# EAGLE design eth_module (EAGLE 6.3)
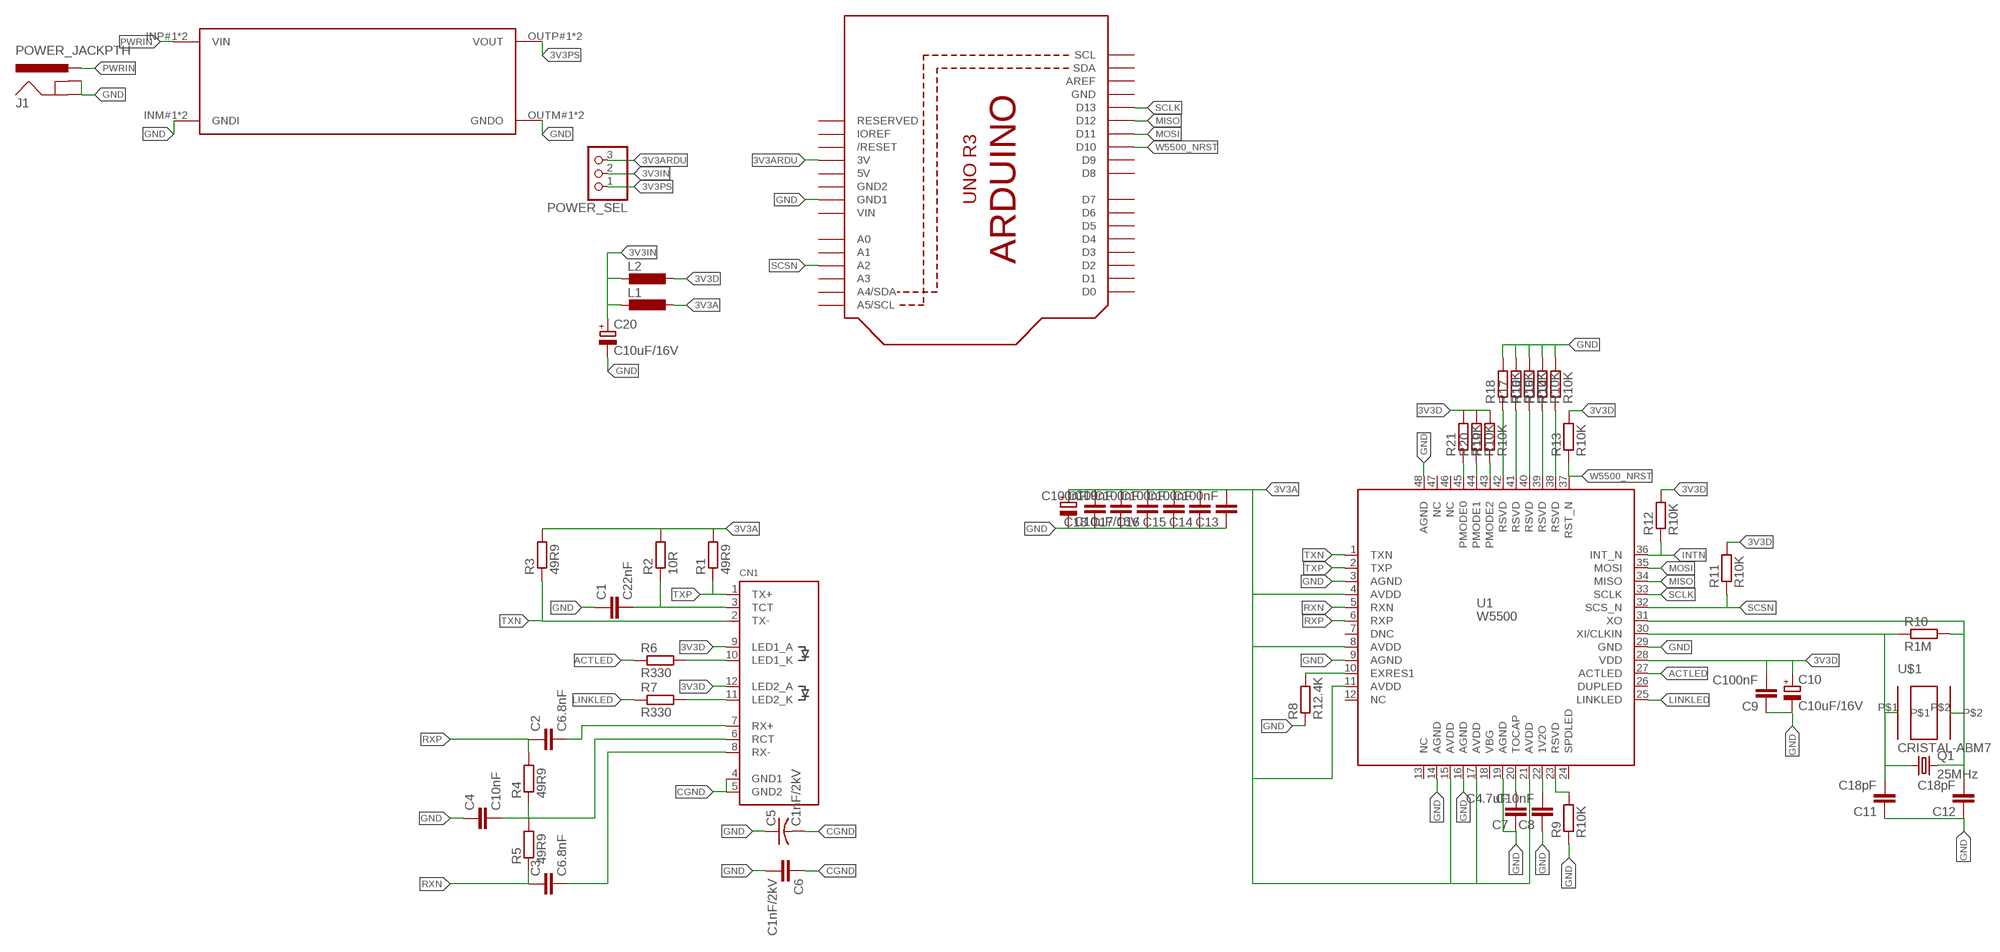
[diagram p0: schematic, sheet 1]

## Parts
C1  C22nF  C-EUC0603  [C0603]
C2  C6.8nF  C-EUC0603  [C0603]
C3  C6.8nF  C-EUC0603  [C0603]
C4  C10nF  C-EUC0603  [C0603]
C5  C1nF/2kV  C-US025-025X050  [C025-025X050]
C6  C1nF/2kV  C-EUC0603  [C0603]
C7  C4.7uF  C-EUC0603  [C0603]
C8  C10nF  C-EUC0603  [C0603]
C9  C100nF  C-EUC0603  [C0603]
C10  C10uF/16V  CPOL-EU153CLV-0605  [153CLV-0605]
C11  C18pF  C-EUC0603  [C0603]
C12  C18pF  C-EUC0603  [C0603]
C13  C100nF  C-EUC0603  [C0603]
C14  C100nF  C-EUC0603  [C0603]
C15  C100nF  C-EUC0603  [C0603]
C16  C100nF  C-EUC0603  [C0603]
C17  C100nF  C-EUC0603  [C0603]
C18  C100nF  C-EUC0603  [C0603]
C19  C10uF/16V  CPOL-EU153CLV-0605  [153CLV-0605]
C20  C10uF/16V  CPOL-EU153CLV-0605  [153CLV-0605]
CN1  RJ45J0026D21BNL  [RJ45_PULSEJACK]
J1  POWER_JACKPTH  [POWER_JACK_PTH]
L1  L-EUL2012C  [L2012C]
L2  L-EUL2012C  [L2012C]
POWER_SEL  PINHD-1X3  [1X03]
Q1  25MHz  CRYSTALHC49S  [HC49/S]
R1  49R9  R-EU_R0603  [R0603]
R2  10R  R-EU_R0603  [R0603]
R3  49R9  R-EU_R0603  [R0603]
R4  49R9  R-EU_R0603  [R0603]
R5  49R9  R-EU_R0603  [R0603]
R6  R330  R-EU_R0603  [R0603]
R7  R330  R-EU_R0603  [R0603]
R8  R12.4K  R-EU_R0805  [R0805]
R9  R10K  R-EU_R0603  [R0603]
R10  R1M  R-EU_R0603  [R0603]
R11  R10K  R-EU_R0603  [R0603]
R12  R10K  R-EU_R0603  [R0603]
R13  R10K  R-EU_R0603  [R0603]
R14  R10K  R-EU_R0603  [R0603]
R15  R10K  R-EU_R0603  [R0603]
R16  R10K  R-EU_R0603  [R0603]
R17  R10K  R-EU_R0603  [R0603]
R18  R10K  R-EU_R0603  [R0603]
R19  R10K  R-EU_R0603  [R0603]
R20  R10K  R-EU_R0603  [R0603]
R21  R10K  R-EU_R0603  [R0603]
U1  W5500  [W5500]
U2  ARDUINOR3-DIMENSION  [ARDUINOR3]
U$1  CRISTAL-ABM7  [CRISTAL-ABM7]
U$2  DCDCMODULE_SMALL  [DCDCMODULE-SMALL]

## Nets
3V3A: C13.2 C14.2 C15.2 C16.2 C17.2 C18.2 C19.+ L1.1 R1.2 R2.2 R3.2 U1.4(AVDD) U1.8(AVDD) U1.11(AVDD) U1.15(AVDD) U1.17(AVDD) U1.21(AVDD)
3V3ARDU: POWER_SEL.3 U2.3V
3V3D: C9.2 C10.+ CN1.9(LED1_A) CN1.12(LED2_A) L2.1 R11.2 R12.2 R13.2 R19.2 R20.2 R21.2 U1.28(VDD)
3V3IN: C20.+ L1.2 L2.2 POWER_SEL.2
3V3PS: POWER_SEL.1 U$2.OUTP#1(VOUT) U$2.OUTP#2(VOUT)
ACTLED: R6.1 U1.27(ACTLED)
CGND: C5.2 C6.1 CN1.4(GND1) CN1.5(GND2)
GND: C1.1 C4.1 C5.1 C6.2 C7.1 C8.1 C9.1 C10.- C11.1 C12.1 C13.1 C14.1 C15.1 C16.1 C17.1 C18.1 C19.- C20.- J1.GND J1.GNDBREAK R8.1 R9.1 R14.2 R15.2 R16.2 R17.2 R18.2 U1.3(AGND) U1.9(AGND) U1.14(AGND) U1.16(AGND) U1.19(AGND) U1.29(GND) U1.48(AGND) U2.GND1 U$2.INM#1(GNDI) U$2.INM#2(GNDI) U$2.OUTM#1(GNDO) U$2.OUTM#2(GNDO)
INTN: R12.1 U1.36(INT_N)
LINKLED: R7.1 U1.25(LINKLED)
MISO: U1.34(MISO) U2.D12
MOSI: U1.35(MOSI) U2.D11
N$1: CN1.10(LED1_K) R6.2
N$2: C1.2 CN1.3(TCT) R2.1
N$3: CN1.11(LED2_K) R7.2
N$4: C2.2 CN1.7(RX+)
N$5: C7.2 U1.20(TOCAP)
N$6: C4.2 CN1.6(RCT) R4.1 R5.2
N$7: R9.2 U1.23(RSVD)
N$8: C3.2 CN1.8(RX-)
N$9: R8.2 U1.10(EXRES1)
N$10: C11.2 Q1.1 R10.1 U1.30(XI/CLKIN) U$1.P$1
N$11: C8.2 U1.22(1V2O)
N$12: C12.2 Q1.2 R10.2 U1.31(XO) U$1.P$2
N$13: R14.1 U1.38(RSVD)
N$14: R15.1 U1.39(RSVD)
N$15: R16.1 U1.40(RSVD)
N$16: R17.1 U1.41(RSVD)
N$17: R18.1 U1.42(RSVD)
N$18: R21.1 U1.45(PMODE0)
N$19: R20.1 U1.44(PMODE1)
N$20: R19.1 U1.43(PMODE2)
PWRIN: J1.PWR U$2.INP#1(VIN) U$2.INP#2(VIN)
RXN: C3.1 R5.1 U1.5(RXN)
RXP: C2.1 R4.2 U1.6(RXP)
SCLK: U1.33(SCLK) U2.D13
SCSN: R11.1 U1.32(SCS_N) U2.A2
TXN: CN1.2(TX-) R3.1 U1.1(TXN)
TXP: CN1.1(TX+) R1.1 U1.2(TXP)
W5500_NRST: R13.1 U1.37(RST_N) U2.D10
Unconnected: U1.7(DNC) U1.12(NC) U1.13(NC) U1.18(VBG) U1.24(SPDLED) U1.26(DUPLED) U1.46(NC) U1.47(NC) U2.A0 U2.A1 U2.A3 U2.A4(A4/SDA) U2.A5(A5/SCL) U2.AREF U2.D0 U2.D1 U2.D2 U2.D3 U2.D4 U2.D5 U2.D6 U2.D7 U2.D8 U2.D9 U2.IOREF U2.RESERVED U2.RESET(/RESET) U2.SCL U2.SDA

## Power pins joined to a net without a drawn wire
5VPS: U2.5V
GND: U2.GND
GND2: U2.GND2
VIN: U2.VIN

## Library data of the parts
C1-C4 C6-C9 C11-C18 = resistor:C-EU: CAPACITOR, European symbol
C5 = resistor:C-US: CAPACITOR, American symbol
C10 C19 C20 = resistor:CPOL-EU: POLARIZED CAPACITOR, European symbol
CN1 = microbuilder:RJ45: RJ45 (Ethernet) Connectors J0026D21BNL - RJ45 Connector with internal transformer and 2 LEDs (Yellow/Green). LEDs have max foreward-voltage of 2.5V. LEDs require an external resistor. Digikey: 553-1349-ND J00-0065NL - RJ45 Connector with internal transformer and 2 LEDs (Yellow/Green). LEDs have max foreward-voltage of 2.5V. LEDs require an external resistor. Digikey: 553-1345-ND
J1 = SparkFun-Connectors:POWER_JACK: Power Jack This is the standard 5.5mm barrel jack for power. The PTH is the most common, proven, reliable, footprint. The Slot footprint only works if the mill layer is transmitted to the PCB fab house so be warned. Mating wall wart : TOL-00298 (and others); PROD_ID: PRT-00119
L1 L2 = resistor:L-EU: INDUCTOR, European symbol
POWER_SEL = adafruit:PINHD-1X3: PIN HEADER
Q1 = crystal:CRYSTAL: CRYSTAL; OC_FARNELL: 1667008; OC_NEWARK: unknown
R1-R21 = resistor:R-EU_: RESISTOR, European symbol
U1 = W5500:W5500
U2 = adafruit:ARDUINOR3: This is a new object for the new Arduino R3 - with extra pins that you may want to use (such as IOref, and duplicated A4/A5
U$1 = cristal:CRISTAL-ABM7
U$2 = bontor:DCDCMODULE_SMALL

## Board
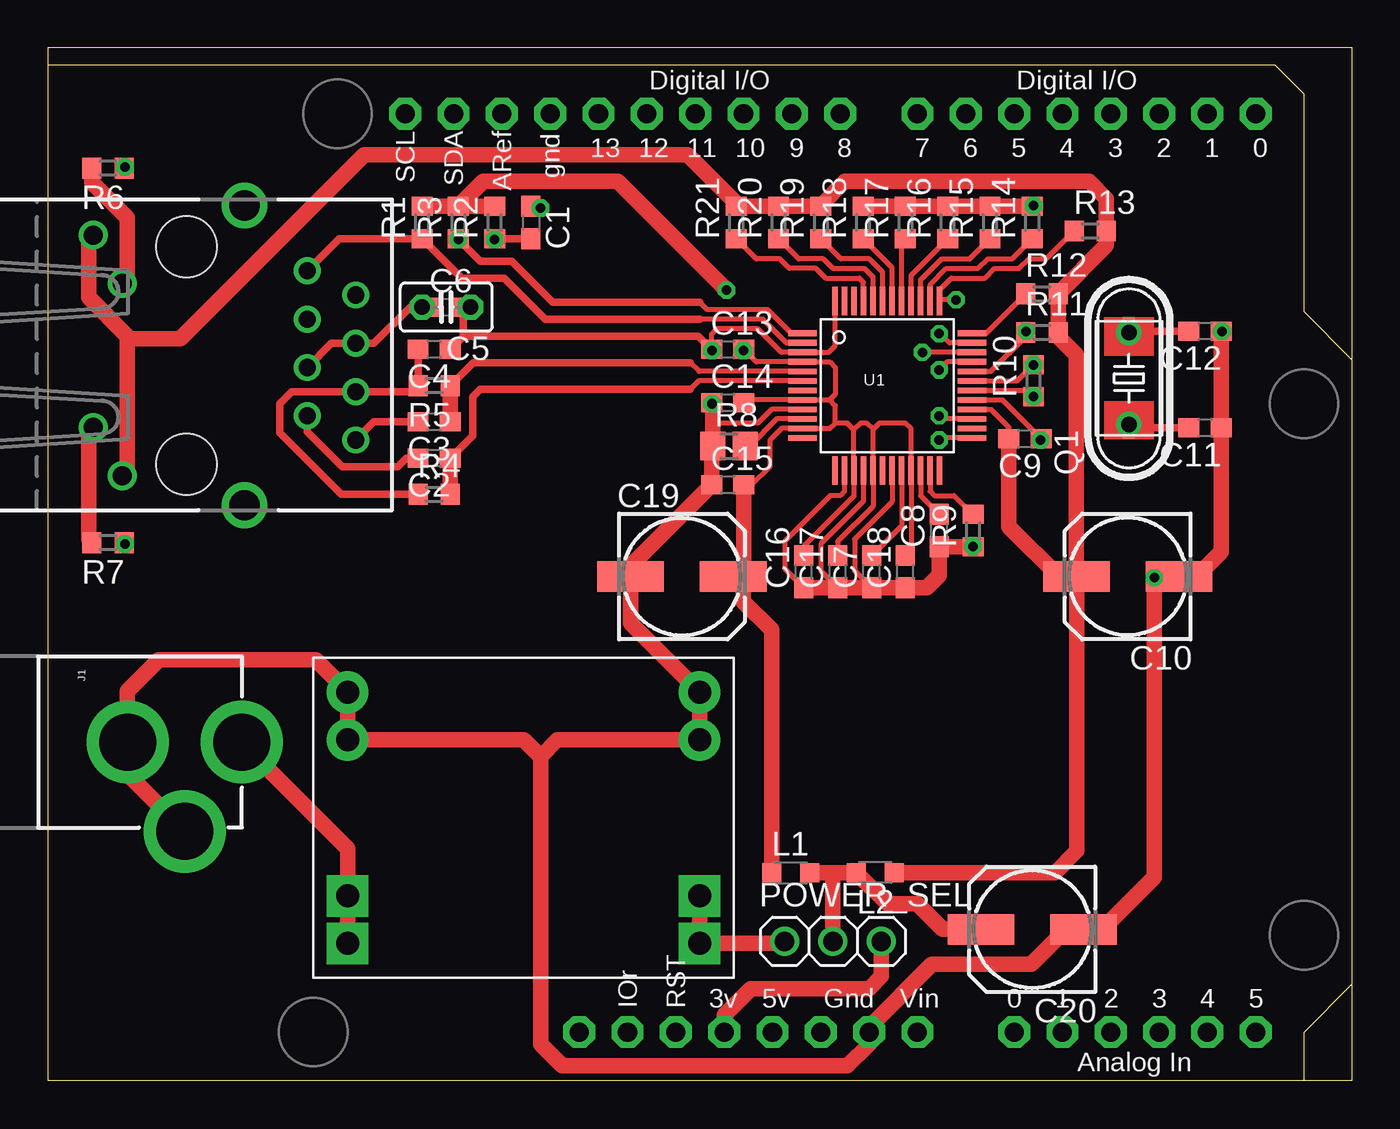
[diagram p1: board, top side]
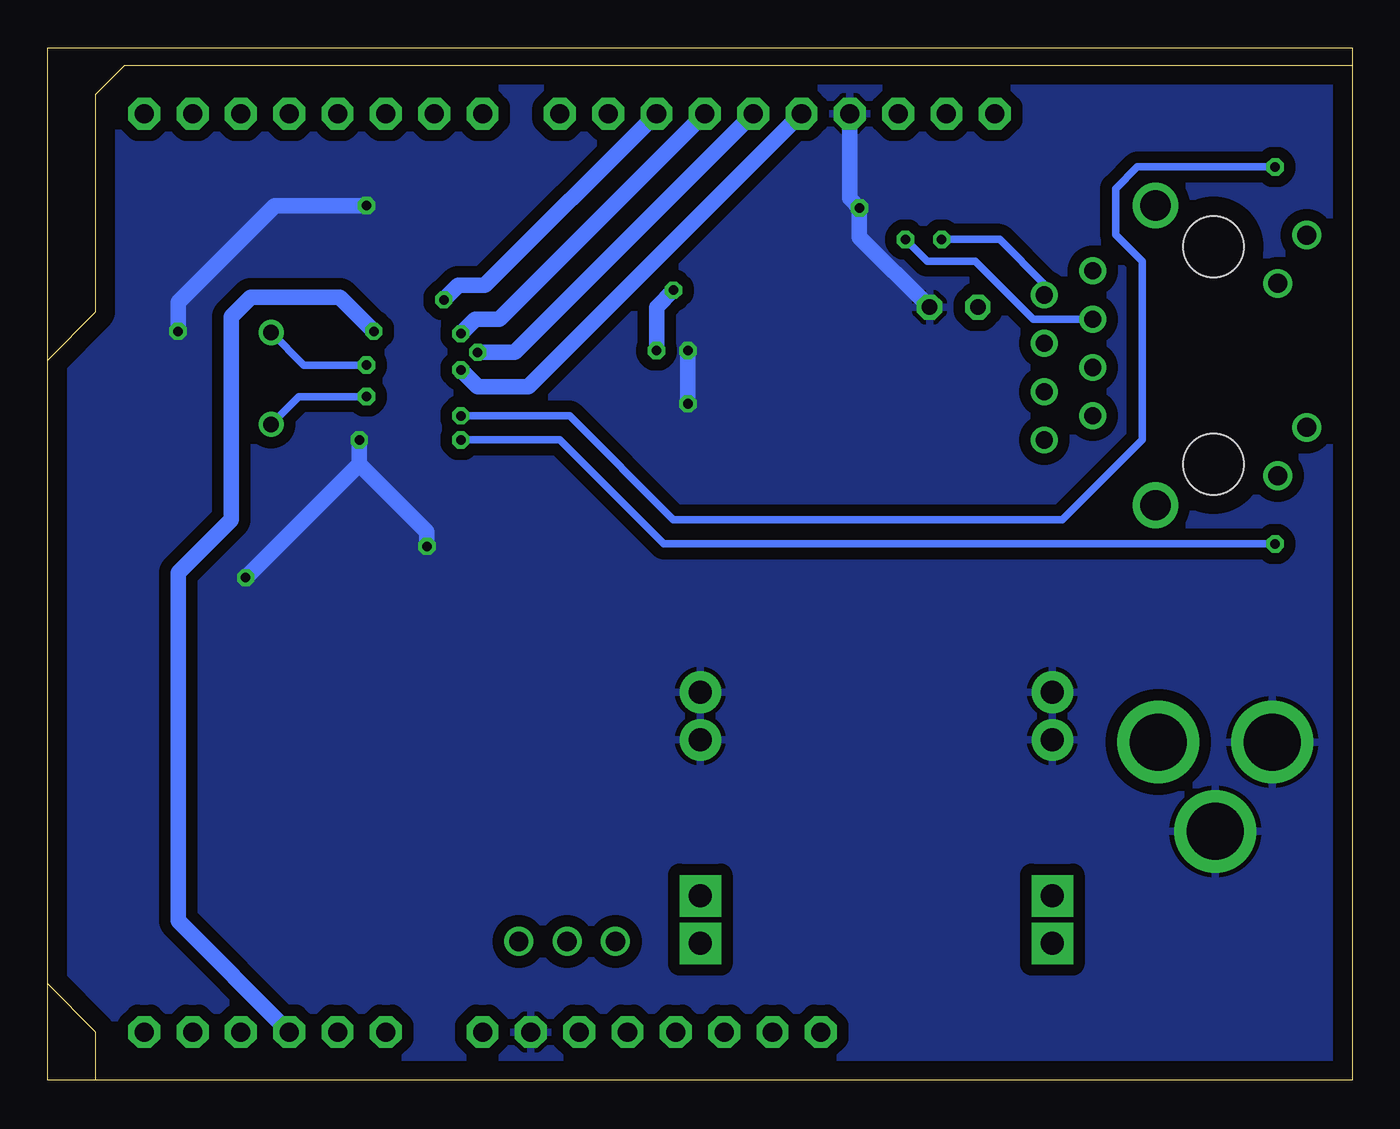
[diagram p2: board, bottom side, seen from below]

Size 68.58 x 54.28 mm. Coordinates in mm from the lower left corner, seen from the top.
Outline: 0,0 68.56,0 68.56,54.28 0,54.28 0,0
Copper layers (1*16): Top 0.035mm / dielectric 1.5mm / Bottom 0.035mm
Design rules "default": minimum track width 10mil, minimum drill 24mil, track to track 8mil, track to pad 8mil, pad to pad 8mil, via to via 8mil, smd to smd 8mil, copper to edge 40mil, drill to drill 8mil, minimum pad ring 10mil, minimum via ring 8mil, stop-mask expansion 4mil, vias tented up to drill 0mil, thermal gap 10mil

### Footprints (pad centres in the part's own frame; a part is rotated, then mirrored left to right if it is on the bottom)
C0603 = smd 1.1 x 1: 1 -0.85,0; 2 0.85,0
C025-025X050 = drill 0.813 octagon: 1 -1.27,0; 2 1.27,0
153CLV-0605 = smd 3.5 x 1.6: + 2.7,0; - -2.7,0
RJ45_PULSEJACK = drill 0.9: 1 4.445,-6.35; 2 3.175,-8.89; 3 1.905,-6.35; 4 0.635,-8.89; 5 -0.635,-6.35; 6 -1.905,-8.89; 7 -3.175,-6.35; 8 -4.445,-8.89 | drill 1: 9 6.325,4.9; 10 3.785,3.38; 11 -3.785,4.9; 12 -6.325,3.38 | drill 1.6: P$5 -7.875,-3.05; P$6 7.875,-3.05 | hole 3.2: -5.715,0; 5.715,0
POWER_JACK_PTH = drill 2.997 pad 4.318: GND 0,7.7; GNDBREAK 4.7,10.7; PWR 0,13.7
L2012C = smd 1 x 1: 1 -1,0; 2 1,0
1X03 = drill 1.016: 1 -2.54,0; 2 0,0; 3 2.54,0
HC49/S = drill 0.813: 1 -2.413,0; 2 2.413,0
R0603 = smd 1 x 1.1: 1 -0.85,0; 2 0.85,0
R0805 = smd 1.3 x 1.5: 1 -0.85,0; 2 0.85,0
W5500 = smd 1.5 x 0.3: 1 -4.45,2.75; 2 -4.45,2.25; 3 -4.45,1.75; 4 -4.45,1.25; 5 -4.45,0.75; 6 -4.45,0.25; 7 -4.45,-0.25; 8 -4.45,-0.75; 9 -4.45,-1.25; 10 -4.45,-1.75; 11 -4.45,-2.25; 12 -4.45,-2.75; 25 4.45,-2.75; 26 4.45,-2.25; 27 4.45,-1.75; 28 4.45,-1.25; 29 4.45,-0.75; 30 4.45,-0.25; 31 4.45,0.25; 32 4.45,0.75; 33 4.45,1.25; 34 4.45,1.75; 35 4.45,2.25; 36 4.45,2.75 | smd 0.3 x 1.5: 13 -2.75,-4.45; 14 -2.25,-4.45; 15 -1.75,-4.45; 16 -1.25,-4.45; 17 -0.75,-4.45; 18 -0.25,-4.45; 19 0.25,-4.45; 20 0.75,-4.45; 21 1.25,-4.45; 22 1.75,-4.45; 23 2.25,-4.45; 24 2.75,-4.45; 37 2.75,4.45; 38 2.25,4.45; 39 1.75,4.45; 40 1.25,4.45; 41 0.75,4.45; 42 0.25,4.45; 43 -0.25,4.45; 44 -0.75,4.45; 45 -1.25,4.45; 46 -1.75,4.45; 47 -2.25,4.45; 48 -2.75,4.45
ARDUINOR3 = drill 1 pad 1.676 octagon: 3V 35.56,2.54; 5V 38.1,2.54; A0 50.8,2.54; A1 53.34,2.54; A2 55.88,2.54; A3 58.42,2.54; A4 60.96,2.54; A5 63.5,2.54; AREF 23.876,50.8; D0 63.5,50.8; D1 60.96,50.8; D2 58.42,50.8; D3 55.88,50.8; D4 53.34,50.8; D5 50.8,50.8; D6 48.26,50.8; D7 45.72,50.8; D8 41.656,50.8; D9 39.116,50.8; D10 36.576,50.8; D11 34.036,50.8; D12 31.496,50.8; D13 28.956,50.8; GND 26.416,50.8; GND1 43.18,2.54; GND2 40.64,2.54; IOREF 30.48,2.54; RESERVED 27.94,2.54; RESET 33.02,2.54; SCL 18.796,50.8; SDA 21.336,50.8; VIN 45.72,2.54
CRISTAL-ABM7 = smd 1.27 x 0.635: P$1 -2.54,0; P$2 2.54,0
DCDCMODULE-SMALL = drill 1.2 pad 2.184: INM#1 1.8,15; INM#2 1.8,12.5; OUTM#1 20.3,15; OUTM#2 20.3,12.5 | drill 1.2 pad 2.184 square: INP#1 1.8,4.3; INP#2 1.8,1.8; OUTP#1 20.3,4.3; OUTP#2 20.3,1.8

### Placement (x,y rotation side)
C1  25.4,45.09 270 top
C2  20.32,32.7 180 top
C3  20.32,34.61 180 top
C4  20.32,38.42 180 top
C5  20.95,40.64 180 top
C6  20.95,40.64 0 top
C7  43.31,26.73 90 top
C8  46.86,28.89 90 top
C9  51.37,33.72 180 top
C10  56.77,26.48 180 top
C11  60.83,34.29 180 top
C12  60.83,39.37 180 top
C13  35.75,38.42 0 top
C14  35.75,35.62 0 top
C15  35.75,31.31 0 top
C16  39.75,26.73 90 top
C17  41.53,26.73 90 top
C18  45.09,26.73 90 top
C19  33.34,26.48 0 top
C20  51.75,7.94 180 top
CN1  7.3,38.1 90 top
J1  -3.49,17.78 270 top
L1  39.05,10.92 0 top
L2  43.5,10.92 180 top
POWER_SEL  41.27,7.3 0 top
Q1  56.83,36.89 90 top
R1  19.68,45.09 90 top
R2  23.5,45.09 90 top
R3  21.59,45.09 90 top
R4  20.32,30.8 0 top
R5  20.32,36.51 180 top
R6  3.17,47.94 180 top
R7  3.17,28.26 180 top
R8  35.81,33.34 0 top
R9  48.64,28.89 90 top
R10  51.82,36.77 90 top
R11  52.26,39.31 0 top
R12  52.26,41.34 0 top
R13  54.8,44.64 0 top
R14  51.75,45.09 90 top
R15  49.53,45.09 90 top
R16  47.31,45.09 90 top
R17  45.09,45.09 90 top
R18  42.86,45.09 90 top
R19  40.64,45.09 90 top
R20  38.42,45.09 90 top
R21  36.2,45.09 90 top
U1  44.13,36.51 0 top
U2  0,0 0 top
U$1  56.83,36.89 90 top
U$2  13.97,5.4 0 top

### Tracks (layer width: path | path; a pad name or v marks a point on that pad's centre or on a via)
3V3A  (via drill 0.5)
  Top 0.254: 41.1,35.76 U1.8 36.74,35.76 C14.2 | 41.1,35.76 41.4,36.07 41.4,37.47 41.1,37.76 U1.4 37.26,37.76 C13.2 | 41.4,34.54 41.12,34.26 U1.11 38.58,34.26 37.97,33.66 37.97,32.26 37.02,31.3 C15.2 | 41.4,34.54 41.4,35.46 41.1,35.76 | 42.38,34.2 U1.15 42.38,30.7 39.75,28.07 C16.2 | 42.38,34.2 42.04,34.54 41.4,34.54 | 43.38,34.22 U1.17 43.38,30.17 41.53,28.32 C17.2 | 43.38,34.22 43.05,34.54 42.73,34.54 42.38,34.2 | 43.38,34.22 43.71,34.54 45.09,34.54 45.38,34.25 U1.21 45.38,27.88 C18.2
  Top 0.406: C13.2 36.6,38.38 v36.58,38.35
  Top 0.813: C15.2 36.6,27.04 36.47,26.91 | 36.47,26.91 C19.+ | R1.2 R3.2 | R3.2 R2.2 | L1.1 38.05,23.67 36.58,25.15 36.58,26.8 36.47,26.91 | R3.2 22.9,47.24 29.97,47.24 v35.69,41.53
  Bottom 0.813: v36.58,38.35 36.58,40.64 v35.69,41.53
3V3ARDU
  Top 0.813: POWER_SEL.3 43.81,5.46 43.18,4.83 36.96,4.83 35.56,3.43 U2.3V
3V3D
  Top 0.254: C9.2 50.52,34.31 49.57,35.26 U1.28
  Top 0.813: C9.2 50.52,29.11 53.21,26.42 54.01,26.42 C10.+ | CN1.9 2.39,44.42 2.16,44.2 2.16,41.15 4.19,39.12 4.19,38.99 | 4.19,38.99 4.19,32.04 CN1.12 | C10.+ 54.07,38.13 53.11,39.09 R11.2 R12.2 55.65,43.88 R13.2 55.65,46.33 54.74,47.24 41.91,47.24 40.64,45.97 R19.2 R20.2 R21.2 36.2,46.1 33.66,48.64 16.64,48.64 6.99,38.99 4.19,38.99 | L2.1 52.96,10.92 54.1,12.06 54.1,26.45 C10.+
3V3IN
  Top 0.813: C20.+ 47.05,7.94 45.72,9.27 44.15,9.27 L2.2 41.15,10.92 | 41.15,10.92 L1.2 | POWER_SEL.2 41.27,10.79 41.15,10.92
3V3PS
  Top 0.813: U$2.OUTP#1 U$2.OUTP#2 38.63,7.2 POWER_SEL.1
ACTLED  (via drill 0.5)
  Top 0.254: U1.27 47.03,34.76 v46.86,34.92
  Top 0.406: v4.06,48.01 4.06,47.98 R6.1
  Bottom 0.406: v46.86,34.92 41.15,34.92 35.69,29.46 15.24,29.46 11.05,33.66 11.05,43.05 12.45,44.45 12.45,46.86 11.3,48.01 v4.06,48.01
CGND
  Top 0.406: CN1.5 14.92,38.73 CN1.4 17.14,38.73 19.05,40.64 C5.2 C6.1
GND  (via drill 0.5)
  Top 0.254: U1.9 38.06,35.26 37.34,34.54 34.96,34.54 | U1.14 41.88,30.96 41.66,30.73 41.15,30.73 38.73,28.32 38.73,26.9 C16.1 | U1.16 42.88,30.44 40.64,28.19 40.64,26.77 C17.1 | C7.1 42.42,26.77 42.42,28.45 44.38,30.41 U1.19 | U1.29 50.18,35.76 C9.1 52.2,33.69 v52.2,33.66 | 21.84,40.64 C5.1 | v58.17,26.42 59.41,26.42 C10.- | R9.1 v48.64,28.07 | v34.92,38.35 34.9,38.38 C13.1 34.9,39.22 35.18,39.5 37.34,39.5 38.57,38.26 U1.3 41.06,38.26 41.38,38.59 U1.48 | 34.96,35.56 v34.92,35.56 | R14.2 51.78,45.94 v51.82,45.97 | C12.1 v61.72,39.37
  Top 0.406: 21.87,39.12 C4.1 | C6.2 21.84,40.64 21.84,39.14 21.87,39.12 | 21.87,39.12 34.2,39.12 C13.1
  Top 0.813: C12.1 C11.1 61.68,27.77 60.33,26.42 59.53,26.42 C10.- | C16.1 C17.1 C7.1 C18.1 46.2,25.88 46.86,26.54 C8.1 R9.1 | R14.2 R15.2 R16.2 R17.2 R18.2 | C14.1 34.96,35.56 34.96,34.54 R8.1 34.9,33.27 C15.1 30.64,27.04 C19.- 30.64,24.03 U$2.OUTM#1 U$2.OUTM#2 26.79,17.9 25.91,17.02 | J1.GNDBREAK 4.21,16.08 J1.GND 4.21,19.16 4.19,19.18 4.19,20.45 5.84,22.1 14.1,22.1 15.77,20.43 U$2.INM#1 U$2.INM#2 25.02,17.91 25.91,17.02 | 25.91,17.02 25.91,1.91 27.05,0.76 42.04,0.76 43.18,1.91 U2.GND1 43.18,2.79 46.48,6.1 51.69,6.1 53.53,7.94 C20.- 55.44,7.94 58.17,10.67 v58.17,26.42 | v25.91,45.85 25.49,45.85 C1.1
  Bottom 0.813: v52.2,33.66 52.2,32.38 | 52.2,32.38 v58.17,26.42 | v48.64,28.07 48.64,28.83 52.2,32.38 | C5.1 25.91,44.32 v25.91,45.85 26.42,46.35 U2.GND | v34.92,35.56 v34.92,38.35 | v51.82,45.97 56.64,45.97 61.72,40.89 v61.72,39.37
  pour Bottom (isolate 0.61): 0,53.47 68.83,53.47 68.83,-0.13 0,-0.13
INTN
  Top 0.254: U1.36 49.33,39.26 R12.1
LINKLED  (via drill 0.5)
  Top 0.254: U1.25 46.97,33.76 v46.86,33.66
  Top 0.406: v4.06,28.19 4.09,28.19 R7.1
  Bottom 0.406: v46.86,33.66 41.66,33.66 36.2,28.19 v4.06,28.19
MISO  (via drill 0.5)
  Top 0.254: U1.34 v45.97,38.26
  Bottom 0.813: U2.D12 44.03,38.26 v45.97,38.26
MOSI  (via drill 0.5)
  Top 0.254: v46.86,39.24 47.4,38.76 U1.35
  Bottom 0.813: U2.D11 44.83,40.01 46.1,40.01 v46.86,39.24
N$1
  Top 0.813: R6.2 2.33,47.2 4.19,45.34 4.19,42.15 CN1.10
N$2  (via drill 0.5)
  Top 0.406: C1.2 R2.1 v23.5,44.2
  Bottom 0.406: CN1.3 16.76,40.01 19.81,43.05 22.35,43.05 v23.5,44.2
N$3
  Top 0.813: R7.2 2.33,28.28 2.16,28.45 2.16,34.07 CN1.11
N$4
  Top 0.406: CN1.7 13.65,34.1 15.49,32.26 18.41,32.26 18.86,32.7 C2.2
N$5
  Top 0.254: U1.20 44.88,29.16 C7.2
N$6
  Top 0.406: C4.2 R5.2 19.15,36.2 CN1.6 12.83,36.2 12.19,35.56 12.19,34.04 15.43,30.8 R4.1
N$7
  Top 0.254: U1.23 46.38,30.96 46.61,30.73 47.65,30.73 R9.2
N$8
  Top 0.406: C3.2 17.14,34.61 CN1.8
N$9
  Top 0.254: U1.10 38.32,34.76 36.89,33.34 R8.2
N$10  (via drill 0.5)
  Top 0.254: U1.30 51.47,36.26 R10.1
  Top 0.406: Q1.1 U$1.P$1 56.9,34.29 C11.2 | R10.1 v51.82,35.94
  Bottom 0.406: v51.82,35.94 55.37,35.94 Q1.1
N$11
  Top 0.254: U1.22 45.88,30.72 C8.2
N$12  (via drill 0.5)
  Top 0.254: U1.31 50.96,36.76 R10.2
  Top 0.406: Q1.2 U$1.P$2 56.9,39.37 C12.2 | v51.82,37.59 R10.2
  Bottom 0.406: v51.82,37.59 55.12,37.59 Q1.2
N$13
  Top 0.254: U1.38 46.38,41.81 47.24,42.67 48.9,42.67 49.4,43.18 50.7,43.18 R14.1
N$14
  Top 0.254: U1.39 45.88,42.07 46.99,43.18 48.48,43.18 R15.1
N$15
  Top 0.254: U1.40 45.38,42.31 R16.1
N$16
  Top 0.254: U1.41 44.88,44.03 R17.1
N$17
  Top 0.254: U1.42 44.38,42.72 R18.1
N$18
  Top 0.254: U1.45 42.88,41.95 42.67,42.16 40.89,42.16 40.39,42.67 38.99,42.67 38.48,43.18 37.25,43.18 R21.1
N$19
  Top 0.254: U1.44 43.38,42.22 42.93,42.67 41.27,42.67 40.77,43.18 39.47,43.18 R20.1
N$20
  Top 0.254: U1.43 43.88,42.48 43.18,43.18 41.7,43.18 R19.1
PWRIN
  Top 0.813: U$2.INP#2 U$2.INP#1 15.77,12.17 10.21,17.73 J1.PWR
RXN
  Top 0.254: U1.5 34.24,37.26 33.78,37.72
  Top 0.406: 33.78,37.72 22.38,37.72 R5.1
  Top 0.813: R5.1 C3.1
RXP
  Top 0.254: U1.6 34.22,36.76 33.78,36.32
  Top 0.406: 33.78,36.32 22.73,36.32 22.35,35.94 22.35,33.88 C2.1
  Top 0.813: C2.1 R4.2
SCLK  (via drill 0.5)
  Top 0.254: U1.33 47.29,37.76 v46.86,37.34
  Bottom 0.813: v46.86,37.34 45.97,36.45 43.31,36.45 U2.D13
SCSN  (via drill 0.5)
  Top 0.254: R11.1 51.41,39.09 49.58,37.26 U1.32
  Top 0.406: v51.44,39.37 51.44,39.33 R11.1
  Bottom 0.813: v51.44,39.37 53.21,41.15 57.91,41.15 58.93,40.13 58.93,29.46 61.72,26.67 61.72,8.38 U2.A2
TXN  (via drill 0.5)
  Top 0.254: U1.1 39.1,39.26 37.85,40.51 34.67,40.51 34.29,40.89
  Top 0.406: R3.1 21.55,44.2 v21.59,44.2 22.73,43.05 24.38,43.05 26.54,40.89 34.29,40.89
  Bottom 0.406: CN1.2 16.19,41.85 18.54,44.2 v21.59,44.2
TXP
  Top 0.254: U1.2 38.83,38.76 37.59,40.01 34.29,40.01
  Top 0.406: CN1.1 15.34,44.23 R1.1 21.76,42.16 24,42.16 26.16,40.01 34.29,40.01
W5500_NRST  (via drill 0.5)
  Top 0.254: R13.1 52.49,43.18 51.56,43.18 51.05,42.67 49.78,42.67 49.28,42.16 47.5,42.16 46.88,41.55 U1.37 46.94,41.02 v47.75,41.02
  Bottom 0.813: U2.D10 45.59,41.78 46.99,41.78 v47.75,41.02